# Altium schematic sheet TPS54528_6V.schdoc
size 307 x 144 mm; SheetNumber: 1; SheetTotal: 1
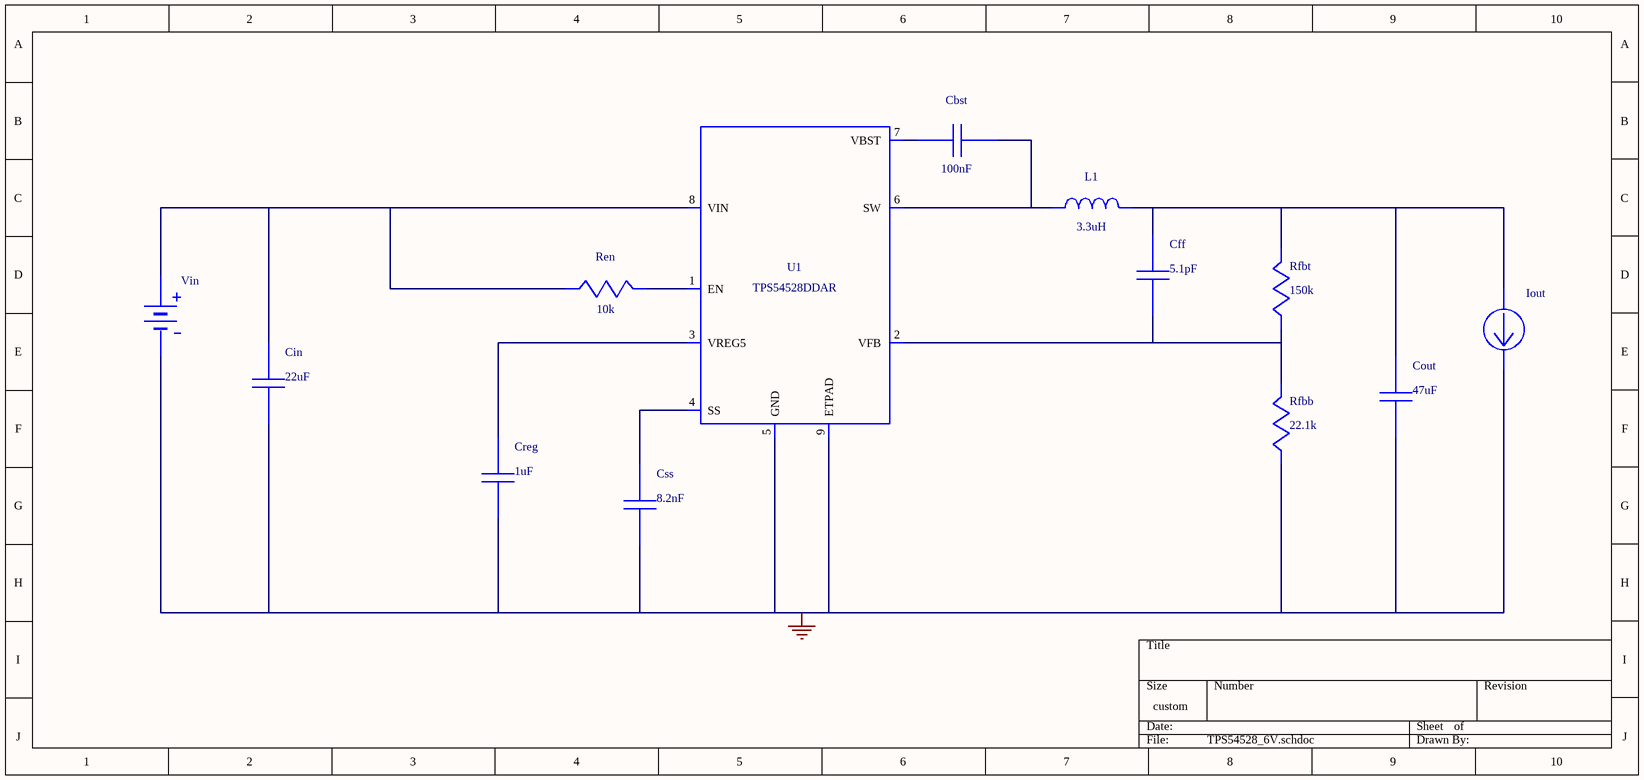
[diagram p0: TPS54528_6V.schdoc]

## Parts
Cbst  value 100nF  (hidden comment: C1005X5R1A104K)
Cff  value 5.1pF  (hidden comment: GRM1555C1E5R1CA01D)
Cin  value 22uF  (hidden comment: GRM32ER61E226KE15L)
Cout  value 47uF  (hidden comment: GRM31CR61A476KE15L)
Creg  value 1uF  (hidden comment: C1608X5R1A105K)
Css  value 8.2nF  (hidden comment: GRM155R71E822KA01D)
Iout  WB_CURRENT_LOAD  (value not drawn)
L1  value 3.3uH  (hidden comment: IHLP3232DZER3R3M11)
Ren  value 10k  (hidden comment: CRCW040210K0FKED)
Rfbb  value 22.1k  (hidden comment: CRCW040222K1FKED)
Rfbt  value 150k  (hidden comment: CRCW0402150KFKED)
U1  TPS54528DDAR
Vin  WB_BATTERY  (value not drawn)

## Nets
0: Cin.2 Cout.2 Creg.2 Css.2 Iout.2(-) Rfbb.2 U1.5(GND) U1.9(ETPAD) Vin.2(-)
NetCbst_1: Cbst.1 U1.7(VBST)
NetCbst_2: Cbst.2 L1.1 U1.6(SW)
NetCff_1: Cff.1 Cout.1 Iout.1(+) L1.2 Rfbt.1
NetCff_2: Cff.2 Rfbb.1 Rfbt.2 U1.2(VFB)
NetCin_1: Cin.1 Ren.2 U1.8(VIN) Vin.1(+)
NetCreg_1: Creg.1 U1.3(VREG5)
NetCss_1: Css.1 U1.4(SS)
NetRen_1: Ren.1 U1.1(EN)

## Library data of the parts
Cbst = C1005X5R1A104K: Manufacturer Name: TDK; PackageReference: C1005X5R1A104K; Manufacturer Part Number: C1005X5R1A104K
Cff = GRM1555C1E5R1CA01D: GRM1555C1E5R1CA0; Manufacturer Name: MuRata; PackageReference: GRM1555C1E5R1CA01D; Manufacturer Part Number: GRM1555C1E5R1CA01D
Cin = GRM32ER61E226KE15L: GRM32ER61E226KE1; Manufacturer Name: MuRata; PackageReference: GRM32ER61E226KE15L; Manufacturer Part Number: GRM32ER61E226KE15L
Cout = GRM31CR61A476KE15L: GRM31CR61A476KE1; Manufacturer Name: MuRata; PackageReference: GRM31CR61A476KE15L; Manufacturer Part Number: GRM31CR61A476KE15L
Creg = C1608X5R1A105K: Manufacturer Name: TDK; PackageReference: C1608X5R1A105K; Manufacturer Part Number: C1608X5R1A105K
Css = GRM155R71E822KA01D: GRM155R71E822KA0; Manufacturer Name: MuRata; PackageReference: GRM155R71E822KA01D; Manufacturer Part Number: GRM155R71E822KA01D
Iout = WB_CURRENT_LOAD: Value: UNLISTED; PackageReference: WB_CURRENT_LOAD; Manufacturer Part Number: WB_CURRENT_LOAD; Manufacturer Name: WB_CURRENT_LOAD
L1 = IHLP3232DZER3R3M11: Unknown; Manufacturer Name: Vishay-Dale; PackageReference: IHLP3232DZER3R3M11; Manufacturer Part Number: IHLP3232DZER3R3M11
Ren = CRCW040210K0FKED: Manufacturer Name: Vishay-Dale; PackageReference: CRCW040210K0FKED; Manufacturer Part Number: CRCW040210K0FKED
Rfbb = CRCW040222K1FKED: Manufacturer Name: Vishay-Dale; PackageReference: CRCW040222K1FKED; Manufacturer Part Number: CRCW040222K1FKED
Rfbt = CRCW0402150KFKED: Manufacturer Name: Vishay-Dale; PackageReference: CRCW0402150KFKED; Manufacturer Part Number: CRCW0402150KFKED
U1 = TPS54528DDAR: Manufacturer Name: Texas Instruments; Value: UNLISTED; PackageReference: TPS54528DDAR; Manufacturer Part Number: TPS54528DDAR
Vin = WB_BATTERY: Value: UNLISTED; PackageReference: WB_BATTERY; Manufacturer Part Number: WB_BATTERY; Manufacturer Name: WB_BATTERY